# EAGLE schematic datalogger v1 (EAGLE 9.6.2)
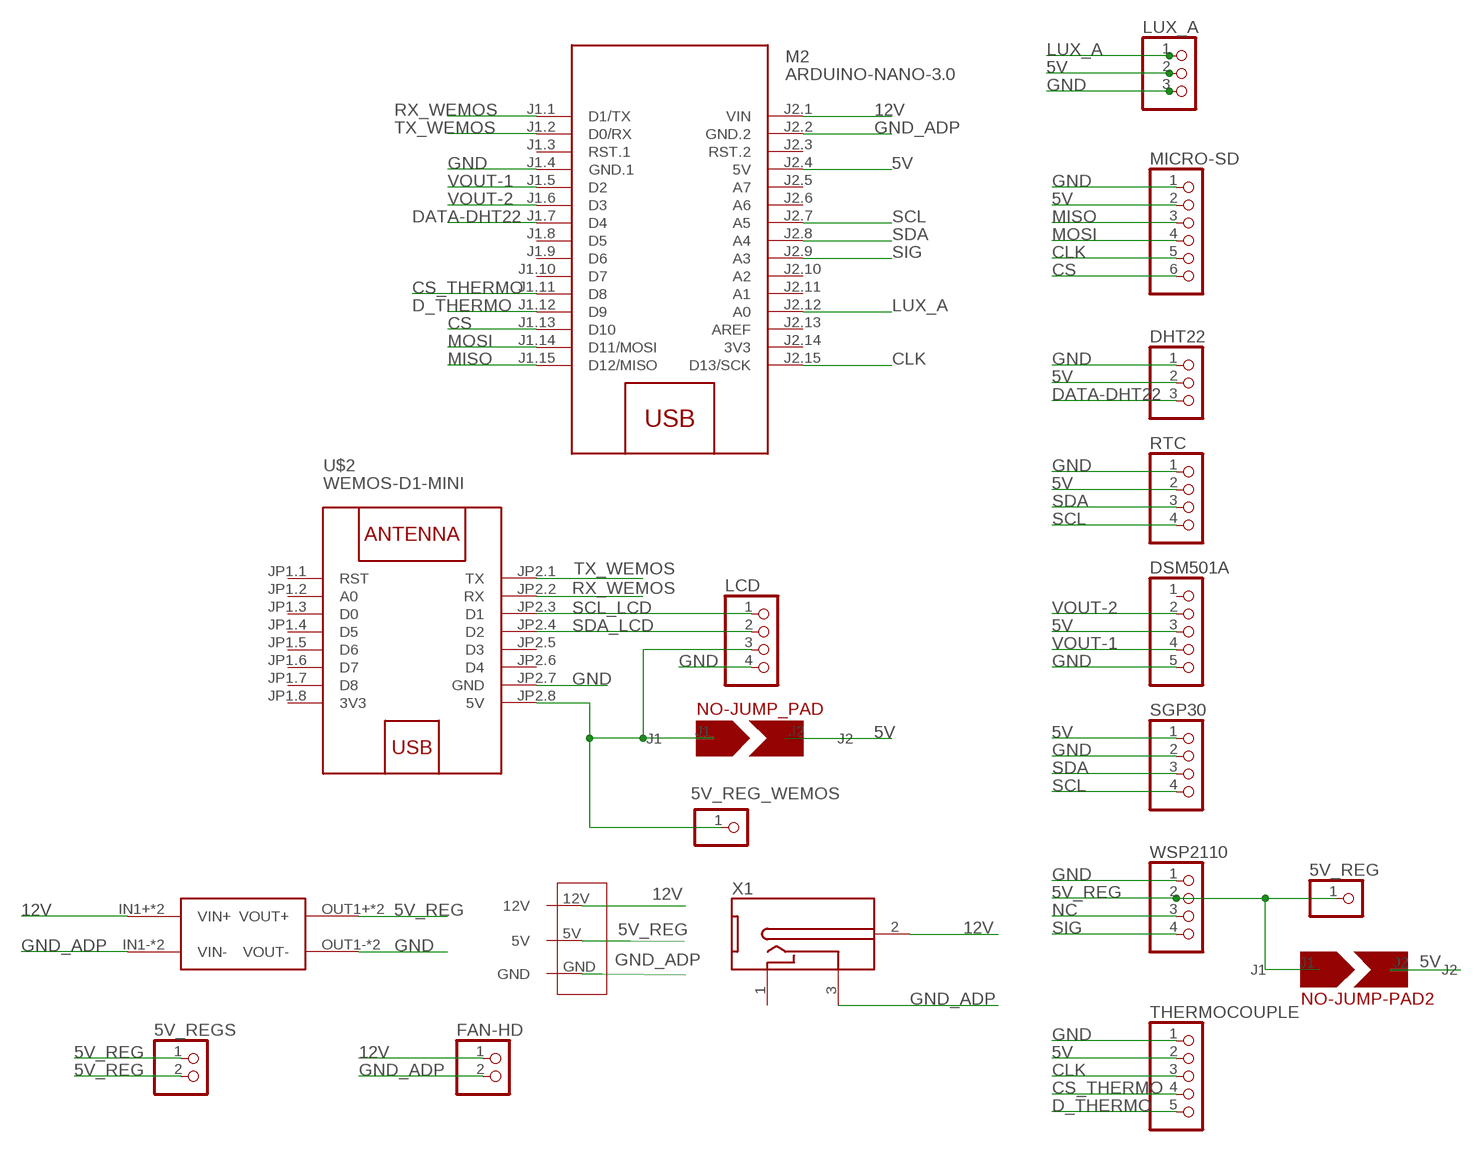
[diagram p0: schematic, sheet 1]

## Parts
5V_REG  PINHD-1X1  [1X01]
5V_REG_WEMOS  PINHD-1X1  [1X01]
5V_REGS  PINHD-1X2  [1X02]
DHT22  PINHD-1X3  [1X03]
DSM501A  PINHD-1X5  [1X05]
FAN-HD  PINHD-1X2  [1X02]
LCD  PINHD-1X4  [1X04]
LUX_A  PINHD-1X3  [1X03]
M2  ARDUINO-NANO-3.0  [ARDUINO-NANO-3.0]
MICRO-SD  PINHD-1X6  [1X06]
NO-JUMP-PAD2  JUMP-NO  [JOMP-NO]
NO-JUMP_PAD  JUMP-NO  [JOMP-NO]
RTC  PINHD-1X4  [1X04]
SGP30  PINHD-1X4  [1X04]
THERMOCOUPLE  PINHD-1X5  [1X05]
U$1  MP1584  [DC-BRICK]
U$2  WEMOS-D1-MINI  [WEMOS-D1-MINI]
U$3  EDGE_CONNECTOR  [EDGE_CONNECTOR]
WSP2110  PINHD-1X4  [1X04]
X1  DC-2.1MM-5MM  [DC-21MM]

## Nets
5V: DHT22.2 DSM501A.3 LUX_A.2 M2.J2.4(5V) MICRO-SD.2 NO-JUMP-PAD2.J2 NO-JUMP_PAD.J2 RTC.2 SGP30.1 THERMOCOUPLE.2
5V_REG: 5V_REG.1 5V_REGS.1 5V_REGS.2 NO-JUMP-PAD2.J1 U$1.OUT1+(VOUT+) U$1.OUT2+(VOUT+) U$3.5V WSP2110.2
12V: FAN-HD.1 M2.J2.1(VIN) U$1.IN1+(VIN+) U$1.IN2+(VIN+) U$3.12V X1.2
CLK: M2.J2.15(D13/SCK) MICRO-SD.5 THERMOCOUPLE.3
CS: M2.J1.13(D10) MICRO-SD.6
CS_THERMO: M2.J1.11(D8) THERMOCOUPLE.4
D_THERMO: M2.J1.12(D9) THERMOCOUPLE.5
DATA-DHT22: DHT22.3 M2.J1.7(D4)
GND: DHT22.1 DSM501A.5 LCD.4 LUX_A.3 M2.J1.4(GND.1) MICRO-SD.1 RTC.1 SGP30.2 THERMOCOUPLE.1 U$1.OUT1-(VOUT-) U$1.OUT2-(VOUT-) U$2.JP2.7(GND) WSP2110.1
GND_ADP: FAN-HD.2 M2.J2.2(GND.2) U$1.IN1-(VIN-) U$1.IN2-(VIN-) U$3.GND X1.3
LUX_A: LUX_A.1 M2.J2.12(A0)
MISO: M2.J1.15(D12/MISO) MICRO-SD.3
MOSI: M2.J1.14(D11/MOSI) MICRO-SD.4
N$2: 5V_REG_WEMOS.1 LCD.3 NO-JUMP_PAD.J1 U$2.JP2.8(5V)
NC: WSP2110.3
RX_WEMOS: M2.J1.1(D1/TX) U$2.JP2.2(RX)
SCL: M2.J2.7(A5) RTC.4 SGP30.4
SCL_LCD: LCD.1 U$2.JP2.3(D1)
SDA: M2.J2.8(A4) RTC.3 SGP30.3
SDA_LCD: LCD.2 U$2.JP2.4(D2)
SIG: M2.J2.9(A3) WSP2110.4
TX_WEMOS: M2.J1.2(D0/RX) U$2.JP2.1(TX)
VOUT-1: DSM501A.4 M2.J1.5(D2)
VOUT-2: DSM501A.2 M2.J1.6(D3)
Unconnected: DSM501A.1 M2.J1.3(RST.1) M2.J1.8(D5) M2.J1.9(D6) M2.J1.10(D7) M2.J2.3(RST.2) M2.J2.5(A7) M2.J2.6(A6) M2.J2.10(A2) M2.J2.11(A1) M2.J2.13(AREF) U$2.JP1.1(RST) U$2.JP1.2(A0) U$2.JP1.3(D0) U$2.JP1.4(D5) U$2.JP1.5(D6) U$2.JP1.6(D7) U$2.JP1.7(D8) U$2.JP2.5(D3) U$2.JP2.6(D4)

## Power pins joined to a net without a drawn wire
1: X1.1
3V3: M2.J2.14(3V3) U$2.JP1.8(3V3)

## Library data of the parts
5V_REG 5V_REG_WEMOS = pinhead:PINHD-1X1: PIN HEADER
5V_REGS FAN-HD = pinhead:PINHD-1X2: PIN HEADER
DHT22 = adafruit:PINHD-1X3: PIN HEADER
DSM501A THERMOCOUPLE = pinhead:PINHD-1X5: PIN HEADER
LCD RTC SGP30 WSP2110 = pinhead:PINHD-1X4: PIN HEADER
LUX_A = pinhead:PINHD-1X3: PIN HEADER
M2 = diy-modules:ARDUINO-NANO-3.0: Arduino Nano 3.0 and compatible devices More details available here: https://www.arduino.cc/en/Main/ArduinoBoardNano Click here to find device on ebay.com <http://www.ebay.com/sch/arduino+nano>
MICRO-SD = adafruit:PINHD-1X6: PIN HEADER
NO-JUMP-PAD2 NO-JUMP_PAD = P_Dusk:JUMP-NO
U$1 = MP1584-dc-brick:MP1584: MP1584-dc-brick-pcb Step down Input: 4.5V - 28V Ouput 0.8V - 25V max. 3A Cheap on ebay
U$2 = diy-modules:WEMOS-D1-MINI: WEMOS D1 mini: Mini Wi-Fi Board based on ESP-8266 device More details can be found here: https://www.wemos.cc/product/d1-mini.html Click here to find device on ebay.com <http://www.ebay.com/sch/wemos+d1+mini+nodemcu>
U$3 = P_Dusk:EDGE_CONNECTOR: SMD power coonector to 12v-5v buck converter
X1 = power-jack:DC: 5mm x 2.1mm jack